# Altium schematic sheet F100SoC.SchDoc
size A4; Organization: Altium Limited; Address1: L3, 12a Rodborough Rd; Address2: Frenchs Forest; Address3: NSW; Address4: Australia 2086
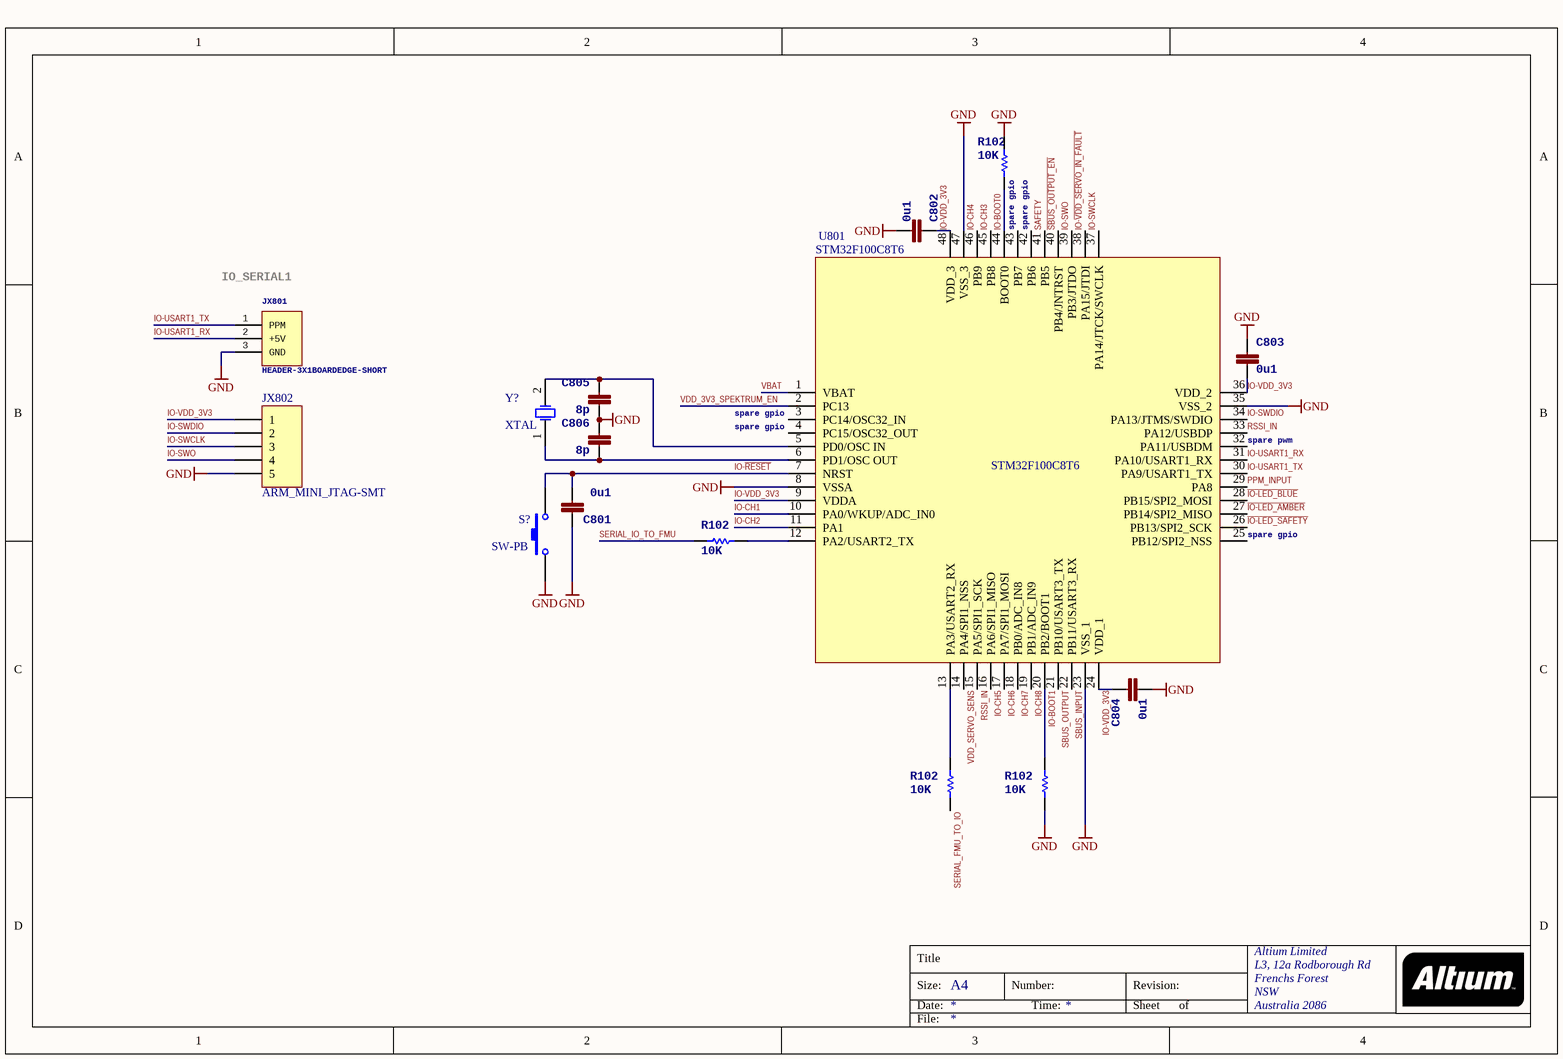
[diagram p0: F100SoC.SchDoc]

## Parts
C801  >NAME: C801  [0603-CAP]  (hidden comment: 0u1)
C802  >NAME: C802  [0603-CAP]  (hidden comment: 0u1)
C803  >NAME: C803  [0603-CAP]  (hidden comment: 0u1)
C804  >NAME: C804  [0603-CAP]  (hidden comment: 0u1)
C805  >NAME: C805  [0603-CAP]  (hidden comment: 8p)
C806  >NAME: C806  [0603-CAP]  (hidden comment: 8p)
JX801  >NAME: JX801  [HEADER_3X01_SMD_H_BOARD_EDGE_SHORT]  (hidden comment: HEADER-3X1BOARDEDGE-SHORT)
JX802  ARM_MINI_JTAG-SMT  [HDR1X5]
R801  >NAME: R102  [0603-RES]  (hidden comment: 10K)
R802  >NAME: R102  [0603-RES]  (hidden comment: 10K)
R803  >NAME: R102  [0603-RES]  (hidden comment: 10K)
R804  >NAME: R102  [0603-RES]  (hidden comment: 10K)
S?  SW-PB  [SPST-2]
U801  STM32F100C8T6
Y?  XTAL  [R38]

## Nets
GND: C801.P$1 C802.P$2 C803.P$1 C804.P$2 C805.P$2 C806.P$1 JX801.3(GND) JX802.5 R801.P$1 R802.P$2 S?.2 U801.8(VSSA) U801.23(VSS_1) U801.35(VSS_2) U801.47(VSS_3)
~{IO-LED_AMBER}: U801.27(PB14/SPI2_MISO)
~{IO-LED_BLUE}: U801.28(PB15/SPI2_MOSI)
~{IO-LED_SAFETY}: U801.26(PB13/SPI2_SCK)
IO-BOOT0: R801.P$2 U801.44(BOOT0)
IO-BOOT1: R802.P$1 U801.20(PB2/BOOT1)
IO-CH1: U801.10(PA0/WKUP/ADC_IN0)
IO-CH2: U801.11(PA1)
IO-CH3: U801.45(PB8)
IO-CH4: U801.46(PB9)
IO-CH5: U801.16(PA6/SPI1_MISO)
IO-CH6: U801.17(PA7/SPI1_MOSI)
IO-CH7: U801.18(PB0/ADC_IN8)
IO-CH8: U801.19(PB1/ADC_IN9)
IO-~{RESET}: C801.P$2 S?.1 U801.7(NRST)
IO-SWCLK: JX802.3 U801.37(PA14/JTCK/SWCLK)
IO-SWDIO: JX802.2 U801.34(PA13/JTMS/SWDIO)
IO-SWO: JX802.4 U801.39(PB3/JTDO)
IO-USART1_RX: JX801.2(+5V) U801.31(PA10/USART1_RX)
IO-USART1_TX: JX801.1(PPM) U801.30(PA9/USART1_TX)
IO-~{VDD_SERVO_IN_FAULT}: U801.38(PA15/JTDI)
IO-VDD_3V3: C802.P$1 C803.P$2 C804.P$1 JX802.1 U801.9(VDDA) U801.24(VDD_1) U801.36(VDD_2) U801.48(VDD_3)
PPM_INPUT: U801.29(PA8)
RSSI_IN: U801.15(PA5/SPI1_SCK) U801.33(PA12/USBDP)
~{SBUS_OUTPUT_EN}: U801.40(PB4/JNTRST)
SAFETY: U801.41(PB5)
SBUS_INPUT: U801.22(PB11/USART3_RX)
SBUS_OUTPUT: U801.21(PB10/USART3_TX)
SERIAL_FMU_TO_IO: R804.P$1
SERIAL_IO_TO_FMU: R803.P$1
VBAT: U801.1(VBAT)
VDD_3V3_SPEKTRUM_EN: U801.2(PC13)
VDD_SERVO_SENS: U801.14(PA4/SPI1_NSS)
NetC805_P$1: C805.P$1 U801.5(PD0/OSC_IN) Y?.2(OSC2)
NetC806_P$2: C806.P$2 U801.6(PD1/OSC_OUT) Y?.1(OSC1)
NetR803_P$2: R803.P$2 U801.12(PA2/USART2_TX)
NetR804_P$2: R804.P$2 U801.13(PA3/USART2_RX)

Not connected (* = marked no-connect by the designer): U801 3(PC14/OSC32_IN) 4(PC15/OSC32_OUT) 25(PB12/SPI2_NSS) 32(PA11/USBDM) 42(PB6) 43(PB7)

## Notes on the sheet
- (near R801) spare gpio
- spare gpio
- (near JX801) IO_SERIAL1
- (near U801) spare gpio
- (near U801) spare pwm
- Title
- Size:
- Date:
- A4
- Number:
- Time:
- Revision:
- Sheet
- of
- File:

## Library data of the parts
C801-C804 = CAP0402: <b>Capacitor</b> / Standard 0603 ceramic capacitor, and 0.1" leaded capacitor.; PARTNO: CC0402ZRY5V7BB104; >VALUE: 0u1
C805 C806 = CAP0402: <b>Capacitor</b> / Standard 0603 ceramic capacitor, and 0.1" leaded capacitor.; PARTNO: C1005C0G1H080C; >VALUE: 8p
JX801 = HEADER-3X1BOARDEDGE-SHORT: <h3>Single row 0.1" servo header</h3>; BOM: EXCLUDE; >VALUE: HEADER-3X1BOARDEDGE-SHORT
JX802 = Header 5: Header, 5-Pin; LatestRevisionDate: 17-Jul-2002; LatestRevisionNote: Re-released for DXP Platform.; Publisher: Altium Limited
R801-R804 = RESISTOR0402-RES: <b>Resistor</b> / Basic schematic elements and footprints for 0603, 1206, and PTH 1/10th watt (small) resistors.; PARTNO: RC0402FR-0710KL; >VALUE: 10K
S? = SW-PB: Switch; Published: 24-Mar-1999; LatestRevisionDate: 17-Jul-2002; LatestRevisionNote: Re-released for DXP Platform.; PackageReference: SPST-2; Publisher: Altium Limited; PackageDescription: Switch; 2 Leads
Y? = XTAL: Crystal Oscillator; Published: 8-Jun-2000; LatestRevisionDate: 17-Jul-2002; LatestRevisionNote: Re-released for DXP Platform.; PackageReference: R38; Publisher: Altium Limited; PackageDescription: Crystal, Thru-Hole; 2 Leads; Body 3.1 x 8.2 mm (Dia.xH)